# Altium schematic sheet painel_meb.SchDoc: Leds, Rtcc + mac address, reset & sinc´s lvds
size A3; Author: Cassio Berni; DrawnBy: CCB; DocumentNumber: 1; Revision: 1_03; SheetNumber: 1; SheetTotal: 1; PageSetup: Record=PageOptions|CenterHorizontal=True|CenterVertical=True|PrintScale=0.73|XCorrection=1.00|YCorrection=1.00|PrintKind=0|BorderSize=5000000|LeftOffset=0|BottomOffset=0|Orientation=2|PaperLength=1000|PaperWidth=1000|Scale=100|PaperSource=7|PrintQuality=-3|MediaType=1|DitherType=10|PrintScaleMode=1|PaperKind=A4|PaperIndex=9
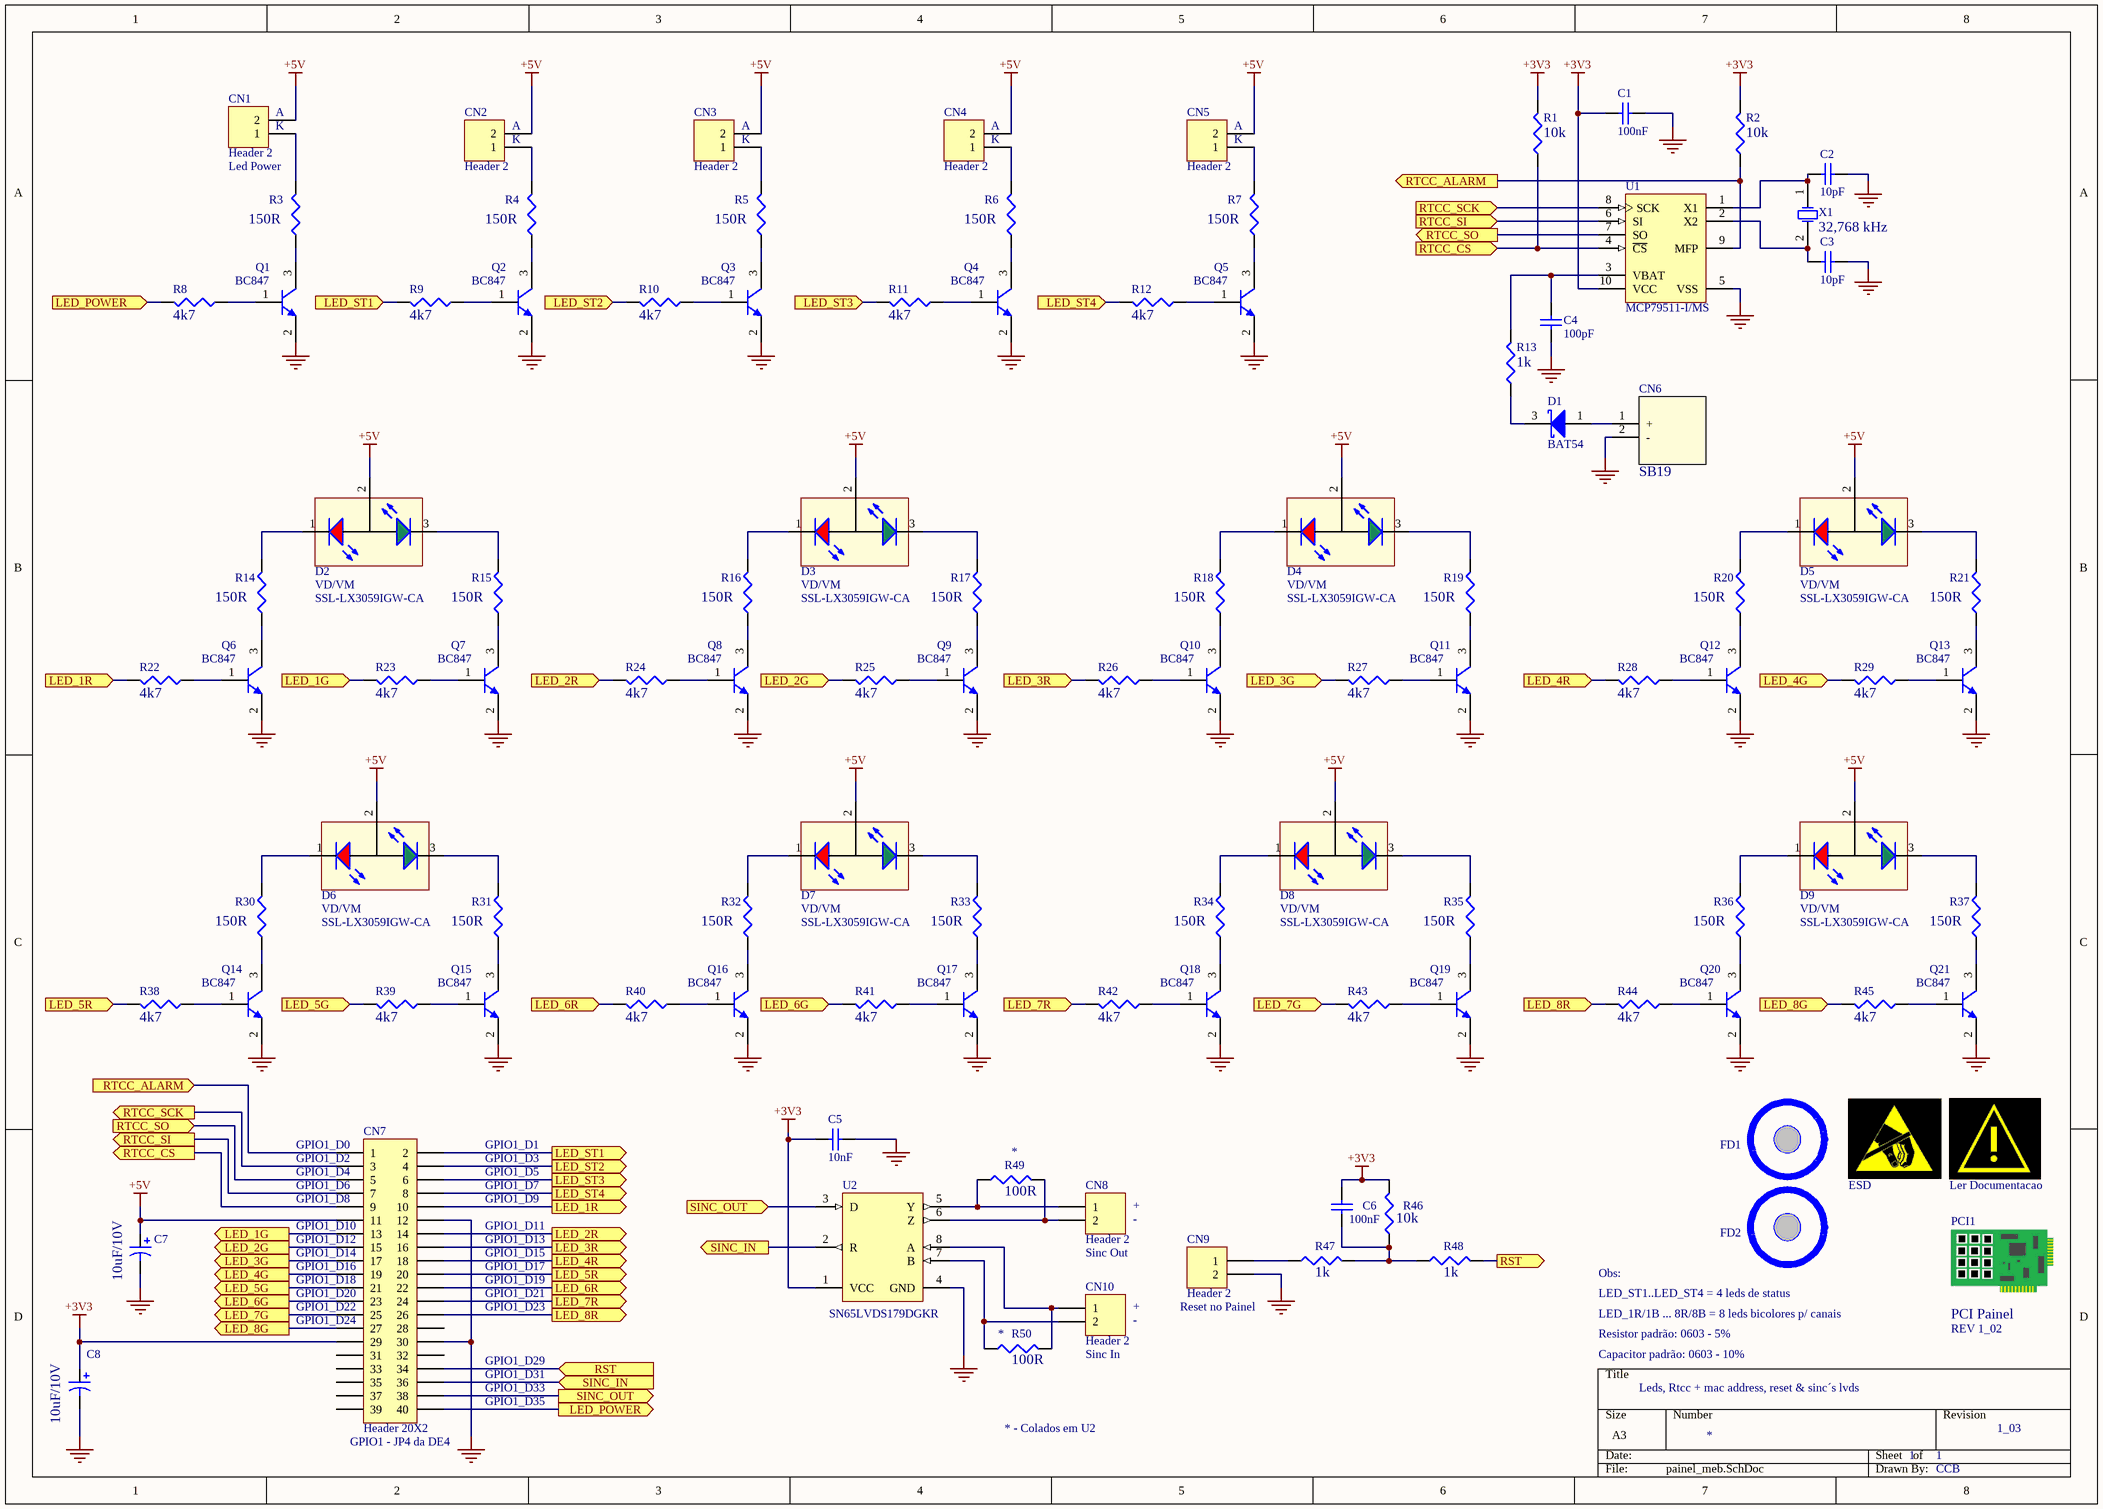
[diagram p0: painel_meb.SchDoc]

## Parts
AT1  Valor: Ler Documentacao  [LEIA_DOCUMENTACAO]  (hidden comment: ##nl)
C1  Valor: 100nF  [0603 - CAP - montagem na maquina]  (hidden comment: Capacitor Cerâmico SMD)
C2  Valor: 10pF  [0603 - CAP - montagem na maquina]  (hidden comment: Capacitor Cerâmico SMD)
C3  Valor: 10pF  [0603 - CAP - montagem na maquina]  (hidden comment: Capacitor Cerâmico SMD)
C4  Valor: 100pF  [0603 - CAP - montagem na maquina]  (hidden comment: Capacitor Cerâmico SMD)
C5  Valor: 10nF  [0603 - CAP - montagem na maquina]  (hidden comment: Capacitor Cerâmico SMD)
C6  Valor: 100nF  [0603 - CAP - montagem na maquina]  (hidden comment: Capacitor Cerâmico SMD)
C7  Valor: 10uF/10V  [CASE-B]  (hidden comment: Capacitor de tântalo)
C8  Valor: 10uF/10V  [CASE-B]  (hidden comment: Capacitor de tântalo)
CN1  Header 2  [HDR1X2]
CN2  Header 2  [HDR1X2]
CN3  Header 2  [HDR1X2]
CN4  Header 2  [HDR1X2]
CN5  Header 2  [HDR1X2]
CN6  Part number: SB19  [Soquete para bateria SB19]  (hidden comment: 11.0137)
CN7  Header 20X2  [HDR2X20]
CN8  Header 2  [HDR1X2]
CN9  Header 2  [HDR1X2]
CN10  Header 2  [HDR1X2]
D1  04.0100  [SOT23-3N - BAT54FAIRCHILD]  (value not drawn)
D2  Valor: VD/VM  [Led 3mm bicolor]  (hidden comment: SSL-LX3059IGW-CA)
D3  Valor: VD/VM  [Led 3mm bicolor]  (hidden comment: SSL-LX3059IGW-CA)
D4  Valor: VD/VM  [Led 3mm bicolor]  (hidden comment: SSL-LX3059IGW-CA)
D5  Valor: VD/VM  [Led 3mm bicolor]  (hidden comment: SSL-LX3059IGW-CA)
D6  Valor: VD/VM  [Led 3mm bicolor]  (hidden comment: SSL-LX3059IGW-CA)
D7  Valor: VD/VM  [Led 3mm bicolor]  (hidden comment: SSL-LX3059IGW-CA)
D8  Valor: VD/VM  [Led 3mm bicolor]  (hidden comment: SSL-LX3059IGW-CA)
D9  Valor: VD/VM  [Led 3mm bicolor]  (hidden comment: SSL-LX3059IGW-CA)
ESD1  ##nl  [ESTATICA]  (value not drawn)
FD1  ##nl  [FIDUCIAL]  (value not drawn)
FD2  ##nl  [FIDUCIAL]  (value not drawn)
PCI1  Valor: PCI Painel  Rev: REV 1_02  (hidden comment: 30.????)
Q1  QNPN  [SOT-23B]  (value not drawn)
Q2  Valor: BC847  [SOT-23B]  (hidden comment: QNPN)
Q3  QNPN  [SOT-23B]  (value not drawn)
Q4  QNPN  [SOT-23B]  (value not drawn)
Q5  QNPN  [SOT-23B]  (value not drawn)
Q6  QNPN  [SOT-23B]  (value not drawn)
Q7  QNPN  [SOT-23B]  (value not drawn)
Q8  QNPN  [SOT-23B]  (value not drawn)
Q9  QNPN  [SOT-23B]  (value not drawn)
Q10  QNPN  [SOT-23B]  (value not drawn)
Q11  QNPN  [SOT-23B]  (value not drawn)
Q12  QNPN  [SOT-23B]  (value not drawn)
Q13  QNPN  [SOT-23B]  (value not drawn)
Q14  QNPN  [SOT-23B]  (value not drawn)
Q15  QNPN  [SOT-23B]  (value not drawn)
Q16  QNPN  [SOT-23B]  (value not drawn)
Q17  QNPN  [SOT-23B]  (value not drawn)
Q18  QNPN  [SOT-23B]  (value not drawn)
Q19  QNPN  [SOT-23B]  (value not drawn)
Q20  QNPN  [SOT-23B]  (value not drawn)
Q21  QNPN  [SOT-23B]  (value not drawn)
R1  Valor: 10k  [0603 - MONTAGEM MÁQUINA]  (hidden comment: Res3)
R2  Valor: 10k  [0603 - MONTAGEM MÁQUINA]  (hidden comment: Res3)
R3  Valor: 150R  [0603 - MONTAGEM MÁQUINA]  (hidden comment: Res3)
R4  Valor: 150R  [0603 - MONTAGEM MÁQUINA]  (hidden comment: Res3)
R5  Valor: 150R  [0603 - MONTAGEM MÁQUINA]  (hidden comment: Res3)
R6  Valor: 150R  [0603 - MONTAGEM MÁQUINA]  (hidden comment: Res3)
R7  Valor: 150R  [0603 - MONTAGEM MÁQUINA]  (hidden comment: Res3)
R8  Valor: 4k7  [0603 - MONTAGEM MÁQUINA]  (hidden comment: Res3)
R9  Valor: 4k7  [0603 - MONTAGEM MÁQUINA]  (hidden comment: Res3)
R10  Valor: 4k7  [0603 - MONTAGEM MÁQUINA]  (hidden comment: Res3)
R11  Valor: 4k7  [0603 - MONTAGEM MÁQUINA]  (hidden comment: Res3)
R12  Valor: 4k7  [0603 - MONTAGEM MÁQUINA]  (hidden comment: Res3)
R13  Valor: 1k  [0603 - MONTAGEM MÁQUINA]  (hidden comment: Res3)
R14  Valor: 150R  [0603 - MONTAGEM MÁQUINA]  (hidden comment: Res3)
R15  Valor: 150R  [0603 - MONTAGEM MÁQUINA]  (hidden comment: Res3)
R16  Valor: 150R  [0603 - MONTAGEM MÁQUINA]  (hidden comment: Res3)
R17  Valor: 150R  [0603 - MONTAGEM MÁQUINA]  (hidden comment: Res3)
R18  Valor: 150R  [0603 - MONTAGEM MÁQUINA]  (hidden comment: Res3)
R19  Valor: 150R  [0603 - MONTAGEM MÁQUINA]  (hidden comment: Res3)
R20  Valor: 150R  [0603 - MONTAGEM MÁQUINA]  (hidden comment: Res3)
R21  Valor: 150R  [0603 - MONTAGEM MÁQUINA]  (hidden comment: Res3)
R22  Valor: 4k7  [0603 - MONTAGEM MÁQUINA]  (hidden comment: Res3)
R23  Valor: 4k7  [0603 - MONTAGEM MÁQUINA]  (hidden comment: Res3)
R24  Valor: 4k7  [0603 - MONTAGEM MÁQUINA]  (hidden comment: Res3)
R25  Valor: 4k7  [0603 - MONTAGEM MÁQUINA]  (hidden comment: Res3)
R26  Valor: 4k7  [0603 - MONTAGEM MÁQUINA]  (hidden comment: Res3)
R27  Valor: 4k7  [0603 - MONTAGEM MÁQUINA]  (hidden comment: Res3)
R28  Valor: 4k7  [0603 - MONTAGEM MÁQUINA]  (hidden comment: Res3)
R29  Valor: 4k7  [0603 - MONTAGEM MÁQUINA]  (hidden comment: Res3)
R30  Valor: 150R  [0603 - MONTAGEM MÁQUINA]  (hidden comment: Res3)
R31  Valor: 150R  [0603 - MONTAGEM MÁQUINA]  (hidden comment: Res3)
R32  Valor: 150R  [0603 - MONTAGEM MÁQUINA]  (hidden comment: Res3)
R33  Valor: 150R  [0603 - MONTAGEM MÁQUINA]  (hidden comment: Res3)
R34  Valor: 150R  [0603 - MONTAGEM MÁQUINA]  (hidden comment: Res3)
R35  Valor: 150R  [0603 - MONTAGEM MÁQUINA]  (hidden comment: Res3)
R36  Valor: 150R  [0603 - MONTAGEM MÁQUINA]  (hidden comment: Res3)
R37  Valor: 150R  [0603 - MONTAGEM MÁQUINA]  (hidden comment: Res3)
R38  Valor: 4k7  [0603 - MONTAGEM MÁQUINA]  (hidden comment: Res3)
R39  Valor: 4k7  [0603 - MONTAGEM MÁQUINA]  (hidden comment: Res3)
R40  Valor: 4k7  [0603 - MONTAGEM MÁQUINA]  (hidden comment: Res3)
R41  Valor: 4k7  [0603 - MONTAGEM MÁQUINA]  (hidden comment: Res3)
R42  Valor: 4k7  [0603 - MONTAGEM MÁQUINA]  (hidden comment: Res3)
R43  Valor: 4k7  [0603 - MONTAGEM MÁQUINA]  (hidden comment: Res3)
R44  Valor: 4k7  [0603 - MONTAGEM MÁQUINA]  (hidden comment: Res3)
R45  Valor: 4k7  [0603 - MONTAGEM MÁQUINA]  (hidden comment: Res3)
R46  Valor: 10k  [0603 - MONTAGEM MÁQUINA]  (hidden comment: Res3)
R47  Valor: 1k  [0603 - MONTAGEM MÁQUINA]  (hidden comment: Res3)
R48  Valor: 1k  [0603 - MONTAGEM MÁQUINA]  (hidden comment: Res3)
R49  Valor: 100R  [0603 - MONTAGEM MÁQUINA]  (hidden comment: Res3)
R50  Valor: 100R  [0603 - MONTAGEM MÁQUINA]  (hidden comment: Res3)
U1  MCP79511-I/MS  [MCHP-MSOP-MS10_N]
U2  PartNumber: SN65LVDS179DGKR  [DGK8_L]  (hidden comment: SN65LVDS179MDGKREP)
X1  Valor: 32,768 kHz  [CRISTAL DT-38]  (hidden comment: XTAL)

## Ports
LED_1G (in), LED_1G (out), LED_1R (in), LED_1R (out), LED_2G (in), LED_2G (out), LED_2R (in), LED_2R (out), LED_3G (in), LED_3G (out), LED_3R (in), LED_3R (out), LED_4G (in), LED_4G (out), LED_4R (in), LED_4R (out), LED_5G (in), LED_5G (out), LED_5R (in), LED_5R (out), LED_6G (in), LED_6G (out), LED_6R (in), LED_6R (out), LED_7G (in), LED_7G (out), LED_7R (in), LED_7R (out), LED_8G (in), LED_8G (out), LED_8R (in), LED_8R (out), LED_POWER (in), LED_POWER (out), LED_ST1 (in), LED_ST1 (out), LED_ST2 (in), LED_ST2 (out), LED_ST3 (in), LED_ST3 (out), LED_ST4 (in), LED_ST4 (out), RST (in), RST (out), RTCC_ALARM (in), RTCC_ALARM (out), RTCC_CS (in), RTCC_CS (out), RTCC_SCK (in), RTCC_SCK (out), RTCC_SI (in), RTCC_SI (out), RTCC_SO (in), RTCC_SO (out), SINC_IN (in), SINC_IN (out), SINC_OUT (in), SINC_OUT (out)

## Nets
+3V3: C1.1 C5.1 C6.2 C8.1 CN7.29 R1.2 R2.2 R46.2 U1.10(VCC) U2.1(VCC)
+5V: C7.1 CN1.2 CN2.2 CN3.2 CN4.2 CN5.2 CN7.11 D2.2(A) D3.2(A) D4.2(A) D5.2(A) D6.2(A) D7.2(A) D8.2(A) D9.2(A)
GND: C1.2 C2.2 C3.2 C4.2 C5.2 C7.2 C8.2 CN6.2(-) CN7.12 CN7.30 CN9.2 Q1.2(E) Q2.2(E) Q3.2(E) Q4.2(E) Q5.2(E) Q6.2(E) Q7.2(E) Q8.2(E) Q9.2(E) Q10.2(E) Q11.2(E) Q12.2(E) Q13.2(E) Q14.2(E) Q15.2(E) Q16.2(E) Q17.2(E) Q18.2(E) Q19.2(E) Q20.2(E) Q21.2(E) U1.5(VSS) U2.4(GND)
LED_1G: CN7.13 R23.2 ; port LED_1G
LED_1R: CN7.10 R22.2 ; port LED_1R
LED_2G: CN7.15 R25.2 ; port LED_2G
LED_2R: CN7.14 R24.2 ; port LED_2R
LED_3G: CN7.17 R27.2 ; port LED_3G
LED_3R: CN7.16 R26.2 ; port LED_3R
LED_4G: CN7.19 R29.2 ; port LED_4G
LED_4R: CN7.18 R28.2 ; port LED_4R
LED_5G: CN7.21 R39.2 ; port LED_5G
LED_5R: CN7.20 R38.2 ; port LED_5R
LED_6G: CN7.23 R41.2 ; port LED_6G
LED_6R: CN7.22 R40.2 ; port LED_6R
LED_7G: CN7.25 R43.2 ; port LED_7G
LED_7R: CN7.24 R42.2 ; port LED_7R
LED_8G: CN7.27 R45.2 ; port LED_8G
LED_8R: CN7.26 R44.2 ; port LED_8R
LED_POWER: CN7.40 R8.2 ; port LED_POWER
LED_ST1: CN7.2 R9.2 ; port LED_ST1
LED_ST2: CN7.4 R10.2 ; port LED_ST2
LED_ST3: CN7.6 R11.2 ; port LED_ST3
LED_ST4: CN7.8 R12.2 ; port LED_ST4
RST: CN7.34 R48.2 ; port RST
RTCC_ALARM: CN7.1 R2.1 U1.9(MFP) ; port RTCC_ALARM
RTCC_CS: CN7.9 R1.1 U1.4(~{CS}) ; port RTCC_CS
RTCC_SCK: CN7.3 U1.8(SCK) ; port RTCC_SCK
RTCC_SI: CN7.7 U1.6(SI) ; port RTCC_SI
RTCC_SO: CN7.5 U1.7(SO) ; port RTCC_SO
SINC_IN: CN7.36 U2.2(R) ; port SINC_IN
SINC_OUT: CN7.38 U2.3(D) ; port SINC_OUT
NetC2_1: C2.1 U1.1(X1) X1.1(OSC1)
NetC3_1: C3.1 U1.2(X2) X1.2(OSC2)
NetC4_1: C4.1 R13.2 U1.3(VBAT)
NetC6_1: C6.1 R46.1 R47.2 R48.1
NetCN1_1: CN1.1 R3.2
NetCN2_1: CN2.1 R4.2
NetCN3_1: CN3.1 R5.2
NetCN4_1: CN4.1 R6.2
NetCN5_1: CN5.1 R7.2
NetCN6_1: CN6.1(+) D1.1(A)
NetCN8_1: CN8.1 R49.1 U2.5(Y)
NetCN8_2: CN8.2 R49.2 U2.6(Z)
NetCN9_1: CN9.1 R47.1
NetCN10_1: CN10.1 R50.2 U2.8(A)
NetCN10_2: CN10.2 R50.1 U2.7(B)
NetD1_3: D1.3(K) R13.1
NetD2_1: D2.1(KR) R14.2
NetD2_3: D2.3(KG) R15.2
NetD3_1: D3.1(KR) R16.2
NetD3_3: D3.3(KG) R17.2
NetD4_1: D4.1(KR) R18.2
NetD4_3: D4.3(KG) R19.2
NetD5_1: D5.1(KR) R20.2
NetD5_3: D5.3(KG) R21.2
NetD6_1: D6.1(KR) R30.2
NetD6_3: D6.3(KG) R31.2
NetD7_1: D7.1(KR) R32.2
NetD7_3: D7.3(KG) R33.2
NetD8_1: D8.1(KR) R34.2
NetD8_3: D8.3(KG) R35.2
NetD9_1: D9.1(KR) R36.2
NetD9_3: D9.3(KG) R37.2
NetQ1_1: Q1.1(B) R8.1
NetQ1_3: Q1.3(C) R3.1
NetQ2_1: Q2.1(B) R9.1
NetQ2_3: Q2.3(C) R4.1
NetQ3_1: Q3.1(B) R10.1
NetQ3_3: Q3.3(C) R5.1
NetQ4_1: Q4.1(B) R11.1
NetQ4_3: Q4.3(C) R6.1
NetQ5_1: Q5.1(B) R12.1
NetQ5_3: Q5.3(C) R7.1
NetQ6_1: Q6.1(B) R22.1
NetQ6_3: Q6.3(C) R14.1
NetQ7_1: Q7.1(B) R23.1
NetQ7_3: Q7.3(C) R15.1
NetQ8_1: Q8.1(B) R24.1
NetQ8_3: Q8.3(C) R16.1
NetQ9_1: Q9.1(B) R25.1
NetQ9_3: Q9.3(C) R17.1
NetQ10_1: Q10.1(B) R26.1
NetQ10_3: Q10.3(C) R18.1
NetQ11_1: Q11.1(B) R27.1
NetQ11_3: Q11.3(C) R19.1
NetQ12_1: Q12.1(B) R28.1
NetQ12_3: Q12.3(C) R20.1
NetQ13_1: Q13.1(B) R29.1
NetQ13_3: Q13.3(C) R21.1
NetQ14_1: Q14.1(B) R38.1
NetQ14_3: Q14.3(C) R30.1
NetQ15_1: Q15.1(B) R39.1
NetQ15_3: Q15.3(C) R31.1
NetQ16_1: Q16.1(B) R40.1
NetQ16_3: Q16.3(C) R32.1
NetQ17_1: Q17.1(B) R41.1
NetQ17_3: Q17.3(C) R33.1
NetQ18_1: Q18.1(B) R42.1
NetQ18_3: Q18.3(C) R34.1
NetQ19_1: Q19.1(B) R43.1
NetQ19_3: Q19.3(C) R35.1
NetQ20_1: Q20.1(B) R44.1
NetQ20_3: Q20.3(C) R36.1
NetQ21_1: Q21.1(B) R45.1
NetQ21_3: Q21.3(C) R37.1

Not connected (* = marked no-connect by the designer): CN7 28 31 32 33 35 37 39

## Notes on the sheet
- Led Power
- (near CN1) A
- (near CN1) K
- (near CN2) A
- (near CN2) K
- (near CN3) A
- (near CN3) K
- (near CN4) A
- (near CN4) K
- (near CN5) A
- (near CN5) K
- (near CN7) GPIO1_D0
- (near CN7) GPIO1_D2
- (near CN7) GPIO1_D4
- (near CN7) GPIO1_D6
- GPIO1_D1
- GPIO1_D3
- GPIO1_D5
- GPIO1_D7
- (near R49) *
- (near CN7) GPIO1_D10
- (near CN7) GPIO1_D12
- (near CN7) GPIO1_D14
- (near CN7) GPIO1_D8
- GPIO1_D9
- GPIO1_D11
- GPIO1_D13
- GPIO1_D15
- (near CN8) Sinc Out
- (near CN8) +
- (near CN8) -
- (near CN7) GPIO1_D16
- (near CN7) GPIO1_D18
- (near CN7) GPIO1_D20
- (near CN7) GPIO1_D22
- (near CN7) GPIO1_D24
- GPIO1_D17
- GPIO1_D19
- GPIO1_D21
- GPIO1_D23
- (near CN10) -
- (near CN10) +
- (near CN9) Reset no Painel
- Obs:
- LED_ST1..LED_ST4 = 4 leds de status
- LED_1R/1B ... 8R/8B = 8 leds bicolores p/ canais
- GPIO1_D33
- GPIO1_D31
- GPIO1_D29
- (near R50) *
- (near CN10) Sinc In
- Resistor padrão: 0603 - 5%
- Capacitor padrão: 0603 - 10%
- (near CN7) GPIO1 - JP4 da DE4
- GPIO1_D35
- * - Colados em U2
- Projeto:
- Revisão:
- Folha:
- Responsável:
- Data:
- Horário:

## Library data of the parts
AT1 = ATENCAO
C7 C8 = Capacitor de tântalo: Grupo: 02
CN1-CN5 CN8-CN10 = Header 2: Header, 2-Pin; LatestRevisionDate: 17-Jul-2002; LatestRevisionNote: Re-released for DXP Platform.; Publisher: Altium Limited
CN6 = Soquete para Bateria CR2032: Fabricante: METALTEX; Grupo: 11; Encapsulamento: CR2032; Datasheet: \\servidor\arquivo\Eletronica\Componentes\SB19.pdf
CN7 = Header 20X2: Header, 20-Pin, Dual row; LatestRevisionDate: 17-Jul-2002; LatestRevisionNote: Re-released for DXP Platform.; Publisher: Altium Limited
D1 = BAT54: Diodo Schottky; Fabricante: FAIRCHILD; Grupo: 04; Part number: BAT54
D2-D9 = SSL-LX3059IGW-CA: Led bicolor pth 3mm verde/vermelho; Grupo: 09; Fabricante: *; Fornecedor: *; Obs: *; Datasheet: *; Encapsulamento: 3mm; Part Number: SSL-LX3059IGW-CA
ESD1 = ESD: Valor: ESD
FD1 FD2 = Fiducial: Valor: *
PCI1 = PCI
Q1 Q3-Q21 = QNPN: NPN Bipolar Transistor; Valor: BC847; Published: 8-Jun-2000; LatestRevisionDate: 17-Jul-2002; LatestRevisionNote: Re-released for DXP Platform.; PackageReference: SOT-23B; Publisher: Altium Limited; Code_JEDEC: SOT-23
Q2 = QNPN: NPN Bipolar Transistor; Published: 8-Jun-2000; LatestRevisionDate: 17-Jul-2002; LatestRevisionNote: Re-released for DXP Platform.; PackageReference: SOT-23B; Publisher: Altium Limited; Code_JEDEC: SOT-23; Valor: Valor
R1-R50 = Res3: Resistor; Grupo: 01
U1 = MCP79511-I/MS: 3 V SPI Real-Time Clock Calendar with Battery Switchover, 10 MHz Communications Speed, 64 Bytes SRAM, -40 to 85 degC, 10-pin MSOP (MS10), Tube; Manufacturer: Microchip; DatasheetVersion: Rev. A; PackageVersion: C04-021C; PackageReference: MSOP-MS10; PackageDescription: 10-Lead Plastic Micro Small Outline Package, 3 x 3 mm Body, 0.5 mm Pitch; Supplier 1: Digi-Key; Supplier Part Number 1: MCP79511-I/MS-ND; Supplier 2: Newark; Supplier Part Number 2: 47T5349; Supplier 3: Mouser; Supplier Part Number 3: 579-MCP79511-I/MS; Mounting Technology: Surface Mount; PartNumber: MCP79511-I/MS; ComponentLink1Description: Manufacturer URL; ComponentLink1URL: http://www.microchip.com; ComponentLink2Description: Datasheet; ComponentLink2URL: http://ww1.microchip.com/downloads/en/DeviceDoc/22300A.pdf; ComponentLink3Description: Package Specification; ComponentLink3URL: http://www.microchip.com/stellent/groups/techpub_sg/documents/packagingspec/en012702.pdf; ComponentLink4Description: Product URL; ComponentLink4URL: http://www.microchip.com/MCP79511
U2 = SN65LVDS179MDGKREP: 400 Mbps Enhanced Product High-Speed Differential Line Driver and Receiver with LVDS, LVTTL Input and LVDS, LVTTL Output, 1 Tx and 1 Rx, -55 to +125 degC, 8-pin VSSOP (DGK), Green (RoHS & no Sb/Br); Manufacturer: Texas Instruments; ESD HBM(kV): 12; Function: Transceiver; No. of Rx: 1; Signaling Rate(Mbps): 400; SubFamily: LVDS PHY (<800Mbps); DatasheetVersion: SGLS203B; PackageVersion: revE, May-2006; PackageReference: DGK8; PackageDescription: 8-Pin Thin Small Outline Package 3 x 3 mm Body ,0.65 mm Pitch; Supplier 1: Digi-Key; Supplier Part Number 1: 296-22243-2-ND; Supplier 2: Digi-Key; Supplier Part Number 2: 296-22243-1-ND; Supplier 3: Digi-Key; Supplier Part Number 3: 296-22243-6-ND; Supplier 4: Newark; Supplier Part Number 4: 45M9838; Supplier 5: Mouser; Supplier Part Number 5: 595-65LVDS179MDGKREP; Eco-Plan: Green (RoHS & no Sb/Br); ICC(Max)(mA): 12; Input Signal: LVDS, LVTTL; No. of Tx: 1; Output Signal: LVDS, LVTTL; Mounting Technology: Surface Mount; Code_JEDEC: MO-187-AA; ComponentLink1Description: Datasheet; ComponentLink1URL: http://www.ti.com/general/docs/lit/getliterature.tsp?genericPartNumber=SN65LVDS179-EP&fileType=pdf; ComponentLink2Description: URL Link1; ComponentLink2URL: SamplesURL:http://www.ti.com/product/sn65lvds179-ep#samples
X1 = XTAL: Cristal oscilador; Encapsulamento: HC-49/S; Fabricante: HIB; Grupo: 06; Published: 8-Jun-2000; LatestRevisionDate: 17-Jul-2002; LatestRevisionNote: Re-released for DXP Platform.; PackageReference: R38; Publisher: Altium Limited; Fornecedor: HIB; Datasheet: \\servidor\arquivo\Eletronica\Componentes\hc-49-sseries.pdf